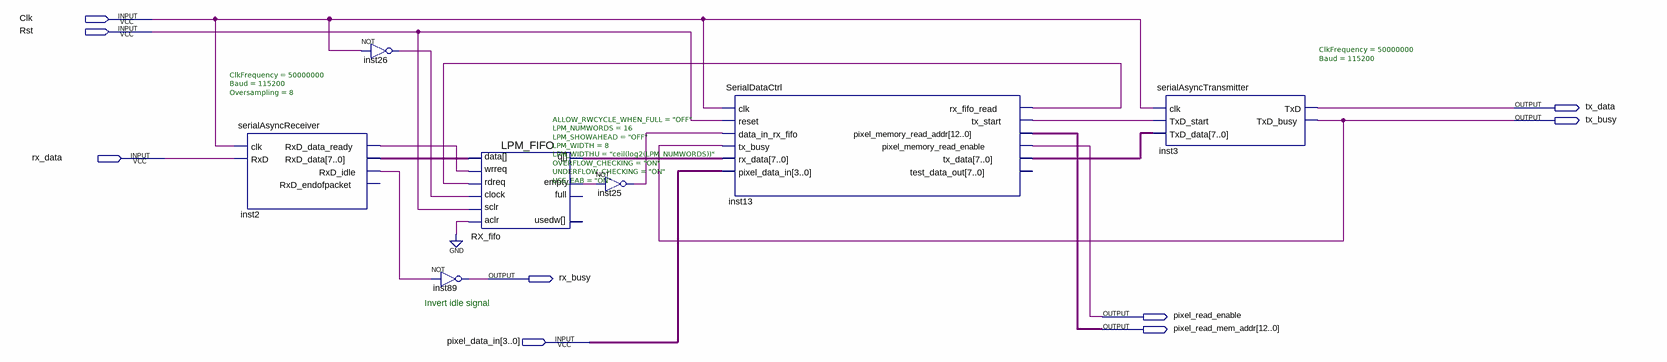
[diagram p0: schematic sheet]
// Quartus schematic SerialController.bdf as structural Verilog: 7 symbols, 9 pins
module SerialController (
  input  Clk,
  input  Rst,
  input  rx_data,
  input  [3:0] pixel_data_in,
  output tx_data,
  output tx_busy,
  output rx_busy,
  output pixel_read_enable,
  output [12:0] pixel_read_mem_addr
);

  wire inst2_rxd_data_ready, inst2_rxd_idle, inst13_rx_fifo_read, inst13_tx_start, inst25_out, inst26_out,
       RX_fifo_empty;
  wire [7:0] inst2_rxd_data, inst13_tx_data, RX_fifo_q;

  serialAsyncReceiver #(.ClkFrequency(50000000), .Baud(115200), .Oversampling(8)) inst2 (
    .clk(Clk), .RxD(rx_data), .RxD_data_ready(inst2_rxd_data_ready), .RxD_data(inst2_rxd_data),
    .RxD_idle(inst2_rxd_idle));  // open: RxD_endofpacket
  not inst26 (inst26_out, Clk);
  not inst89 (rx_busy, inst2_rxd_idle);
  LPM_FIFO #(.ALLOW_RWCYCLE_WHEN_FULL("OFF"), .LPM_NUMWORDS(16), .LPM_SHOWAHEAD("OFF"), .LPM_WIDTH(8), .LPM_WIDTHU("ceil(log2(LPM_NUMWORDS))"), .OVERFLOW_CHECKING("ON"), .UNDERFLOW_CHECKING("ON"), .USE_EAB("ON")) RX_fifo (
    .clock(inst26_out), .data(inst2_rxd_data), .wrreq(inst2_rxd_data_ready), .rdreq(inst13_rx_fifo_read),
    .aclr(1'b0), .sclr(Rst), .q(RX_fifo_q), .empty(RX_fifo_empty));  // open: full, usedw
  not inst25 (inst25_out, RX_fifo_empty);
  SerialDataCtrl inst13 (
    .clk(Clk), .reset(Rst), .data_in_rx_fifo(inst25_out), .tx_busy(tx_busy), .rx_data(RX_fifo_q),
    .pixel_data_in(pixel_data_in), .rx_fifo_read(inst13_rx_fifo_read), .tx_start(inst13_tx_start),
    .pixel_memory_read_addr(pixel_read_mem_addr), .pixel_memory_read_enable(pixel_read_enable),
    .tx_data(inst13_tx_data));  // open: test_data_out
  serialAsyncTransmitter #(.ClkFrequency(50000000), .Baud(115200)) inst3 (
    .clk(Clk), .TxD_start(inst13_tx_start), .TxD_data(inst13_tx_data), .TxD(tx_data), .TxD_busy(tx_busy));

  // Notes on the sheet:
  //   Invert idle signal
endmodule
